# Altium schematic sheet AVR精简学习板.SchDoc
size A4
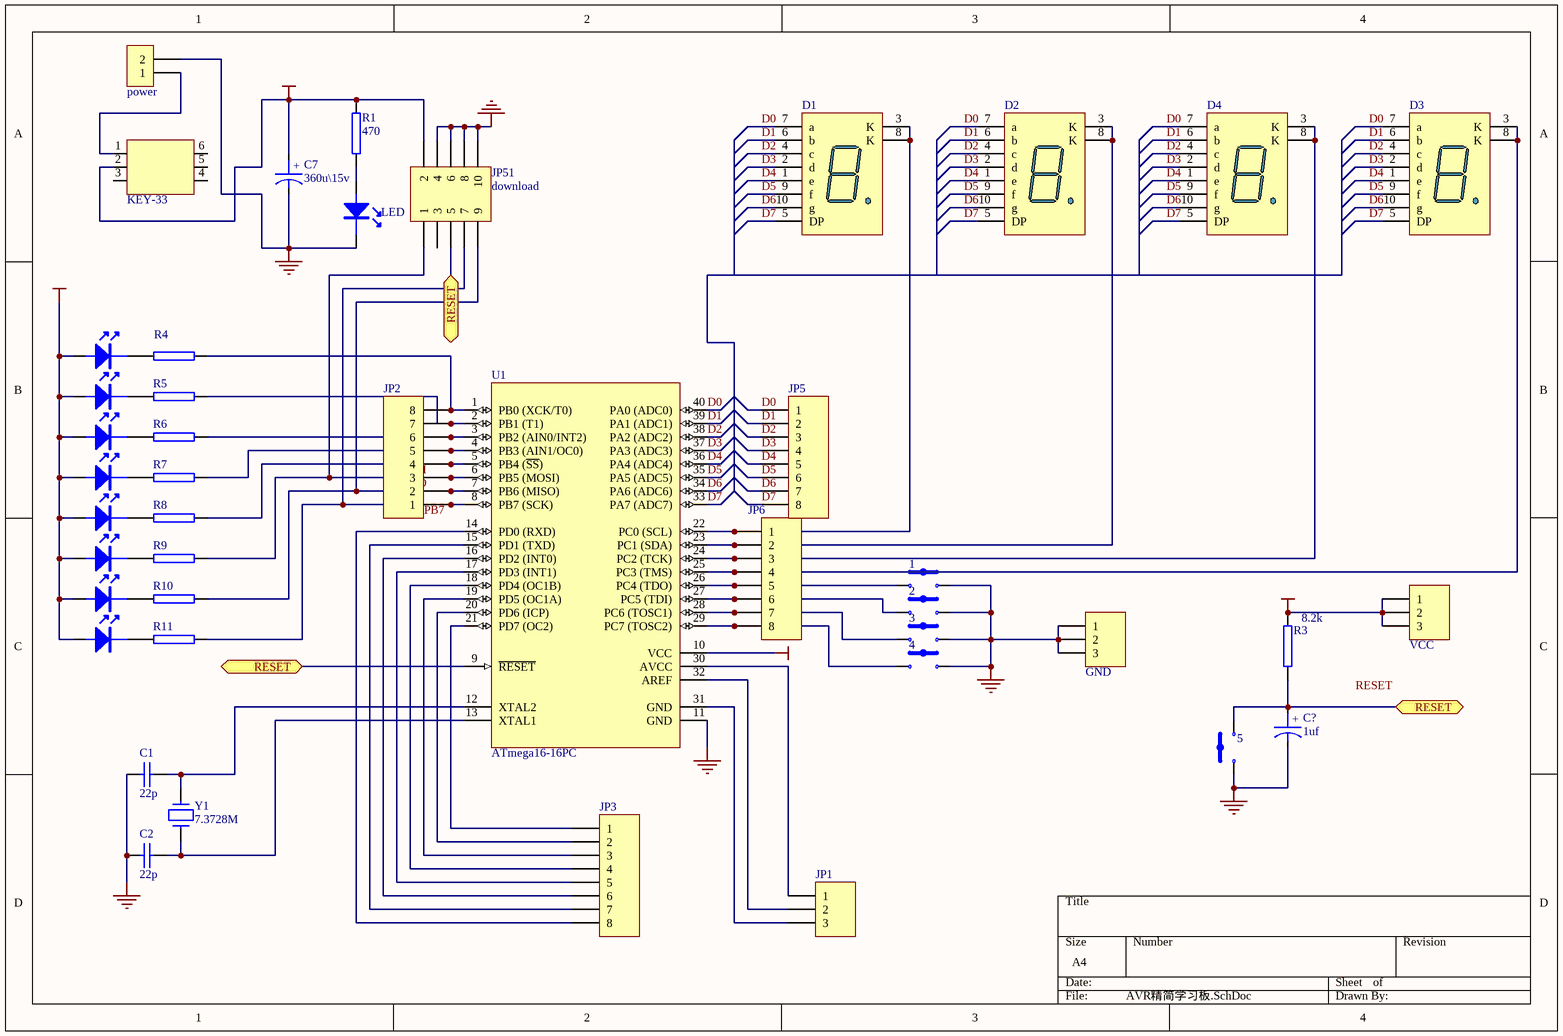
[diagram p0: AVR精简学习板.SchDoc]

## Parts
1  KEY  [KEY-1]  (value not drawn)
2  2  [KEY-1]  (value not drawn)
3  KEY  [KEY-1]  (value not drawn)
4  KEY  [KEY-1]  (value not drawn)
5  KEY  [KEY-1]  (value not drawn)
11  power  [power1]
C1  22p  [RAD0.3]
C2  22p  [RAD0.3]
C7  360u\15v  [cap2]
C?  1uf  [cap2]
D1  3  [LEDDIP-10/C15.24]  (value not drawn)
D2  Dpy Blue-CC  [LEDDIP-10/C15.24]  (value not drawn)
D3  Dpy Blue-CC  [LEDDIP-10/C15.24]  (value not drawn)
D4  Dpy Blue-CC  [LEDDIP-10/C15.24]  (value not drawn)
D5  LED  [LED]  (value not drawn)
D6  LED  [LED]  (value not drawn)
D7  LED  [LED]  (value not drawn)
D8  LED  [LED]  (value not drawn)
D9  LED  [LED]  (value not drawn)
D10  LED  [LED]  (value not drawn)
D11  LED  [LED]  (value not drawn)
D12  LED  [LED]  (value not drawn)
JP1  Header 3  [HDR1X3]  (value not drawn)
JP2  Header 8  [HDR1X8]  (value not drawn)
JP3  Header 8  [HDR1X8]  (value not drawn)
JP5  Header 8  [HDR1X8]  (value not drawn)
JP6  Header 8  [HDR1X8]  (value not drawn)
JP11  VCC  [HDR1X3]
JP12  GND  [HDR1X3]
JP51  download  [HDR2X5]
LED  LED  [LED]  (value not drawn)
R1  470  [AXIAL0.4]
R3  8.2k  [AXIAL0.4]
R4  470  [AXIAL0.4]  (value not drawn)
R5  8.2k  [AXIAL0.4]  (value not drawn)
R6  8.2k  [AXIAL0.4]  (value not drawn)
R7  8.2k  [AXIAL0.4]  (value not drawn)
R8  8.2k  [AXIAL0.4]  (value not drawn)
R9  8.2k  [AXIAL0.4]  (value not drawn)
R10  8.2k  [AXIAL0.4]  (value not drawn)
R11  8.2k  [AXIAL0.4]  (value not drawn)
RT  KEY-33  [KEY-2]
U1  ATmega16-16PC  [40P6]
Y1  7.3728M  [CRYSTAL]

## Ports
RESET

## Nets
GND: 1.2 2.2 3.2 4.2 5.0 11.2 C1.2 C2.1 C7.2 C?.2 JP12.1 JP12.2 JP12.3 JP51.4 JP51.6 JP51.8 JP51.10 LED.2(K) U1.11(GND)
VCC: C7.1 D5.1(A) D6.1(A) D7.1(A) D8.1(A) D9.1(A) D10.1(A) D11.1(A) D12.1(A) JP11.1 JP11.2 JP11.3 JP51.2 R1.1 R3.2 RT.2 U1.10(VCC)
D0: D1.7(a) D2.7(a) D3.7(a) D4.7(a) JP5.1 U1.40(PA0_(ADC0))
D1: D1.6(b) D2.6(b) D3.6(b) D4.6(b) JP5.2 U1.39(PA1_(ADC1))
D2: D1.4(c) D2.4(c) D3.4(c) D4.4(c) JP5.3 U1.38(PA2_(ADC2))
D3: D1.2(d) D2.2(d) D3.2(d) D4.2(d) JP5.4 U1.37(PA3_(ADC3))
D4: D1.1(e) D2.1(e) D3.1(e) D4.1(e) JP5.5 U1.36(PA4_(ADC4))
D5: D1.9(f) D2.9(f) D3.9(f) D4.9(f) JP5.6 U1.35(PA5_(ADC5))
D6: D1.10(g) D2.10(g) D3.10(g) D4.10(g) JP5.7 U1.34(PA6_(ADC6))
D7: D1.5(DP) D2.5(DP) D3.5(DP) D4.5(DP) JP5.8 U1.33(PA7_(ADC7))
MISO: JP2.2 JP51.9 R10.2 U1.7(PB6_(MISO))
MOSI: JP2.3 JP51.1 R9.2 U1.6(PB5_(MOSI))
RESET: 5.2 C?.1 JP51.5 R3.1 U1.9(~{RESET}) ; port RESET
Net1_0: 1.0 JP6.5 U1.26(PC4_(TDO))
Net2_0: 2.0 JP6.6 U1.27(PC5_(TDI))
Net3_0: 3.0 JP6.7 U1.28(PC6_(TOSC1))
Net4_0: 4.0 JP6.8 U1.29(PC7_(TOSC2))
Net11_1: 11.1 RT.1
NetC1_1: C1.1 U1.12(XTAL2) Y1.2
NetC2_2: C2.2 U1.13(XTAL1) Y1.1
NetD1_3: D1.3(K) D1.8(K) JP6.1 U1.22(PC0_(SCL))
NetD2_3: D2.3(K) D2.8(K) JP6.2 U1.23(PC1_(SDA))
NetD3_3: D3.3(K) D3.8(K) JP6.4 U1.25(PC3_(TMS))
NetD4_3: D4.3(K) D4.8(K) JP6.3 U1.24(PC2_(TCK))
NetD5_2: D5.2(K) R4.1
NetD6_2: D6.2(K) R5.1
NetD7_2: D7.2(K) R6.1
NetD8_2: D8.2(K) R7.1
NetD9_2: D9.2(K) R8.1
NetD10_2: D10.2(K) R9.1
NetD11_2: D11.2(K) R10.1
NetD12_2: D12.2(K) R11.1
NetJP1_1: JP1.1 U1.30(AVCC)
NetJP1_2: JP1.2 U1.32(AREF)
NetJP1_3: JP1.3 U1.31(GND)
NetJP2_1: JP2.1 JP51.7 R11.2 U1.8(PB7_(SCK))
NetJP2_4: JP2.4 R8.2 U1.5(PB4_(~{SS}))
NetJP2_5: JP2.5 R7.2 U1.4(PB3_(AIN1/OC0))
NetJP2_6: JP2.6 R6.2 U1.3(PB2_(AIN0/INT2))
NetJP2_7: JP2.7 R5.2 U1.2(PB1_(T1))
NetJP2_8: JP2.8 R4.2 U1.1(PB0_(XCK/T0))
NetJP3_1: JP3.1 U1.21(PD7_(OC2))
NetJP3_2: JP3.2 U1.20(PD6_(ICP))
NetJP3_3: JP3.3 U1.19(PD5_(OC1A))
NetJP3_4: JP3.4 U1.18(PD4_(OC1B))
NetJP3_5: JP3.5 U1.17(PD3_(INT1))
NetJP3_6: JP3.6 U1.16(PD2_(INT0))
NetJP3_7: JP3.7 U1.15(PD1_(TXD))
NetJP3_8: JP3.8 U1.14(PD0_(RXD))
NetLED_1: LED.1(A) R1.2

Not connected (* = marked no-connect by the designer): JP51 3; RT 3 4 5 6

## Notes on the sheet
- Labels drawn without touching a wire or pin: PB7, RESET
- (in symbol CAPACITOR POL) +

## Library data of the parts
2 = KEY
C1 C2 = CAP: Capacitor
C7 C? = CAPACITOR POL: Capacitor
D1-D4 = Dpy Blue-CC: 14.2 mm General Purpose Blue 7-Segment Display: CC, RH DP, Gray Surface; Package Information: Latest Revision: 24-Sep-2002; Min. Intensity: 2020 ucd; Note: IF = 10 mA; Note: Pins 3 and 8 are redundant Cathodes.; Datasheet: Latest Revision: 24-Sep-2002; Package Reference: H; Publisher: Altium Limited; Colour: Blue
JP1 JP11 JP12 = Header 3: Header, 3-Pin; Revision: 17-Jul-2002: Re-released for DXP Platform.; Publisher: Altium Limited
JP2 JP3 JP5 JP6 = Header 8: Header, 8-Pin; Revision: 17-Jul-2002: Re-released for DXP Platform.; Publisher: Altium Limited
JP51 = Header 5X2: Header, 5-Pin, Dual row; Revision: 17-Jul-2002: Re-released for DXP Platform.; Publisher: Altium Limited
R1 R3-R11 = RES2
U1 = ATmega16-16PC: 8-Bit AVR Microcontroller with 16K Bytes of In-System Programmable Flash Memory; Published: 17-Sep-2003; LatestRevisionDate: 4-Mar-2005; LatestRevisionNote: Stylized 3D Model Added.; DatasheetDocument: 2466E-AVR-10/02; PackageDocument: Dec-1999; PackageReference: 40P6; Publisher: Altium Limited; ComponentLink1Description: Manufacturer Link; ComponentLink1URL: http://www.atmel.com; ComponentLink2Description: Datasheet; ComponentLink2URL: http://www.atmel.com/dyn/resources/prod_documents/doc2466.pdf
Y1 = CRYSTAL